# Altium schematic sheet Net.SchDoc: 网络接口
size A4; Author: 陈世豪
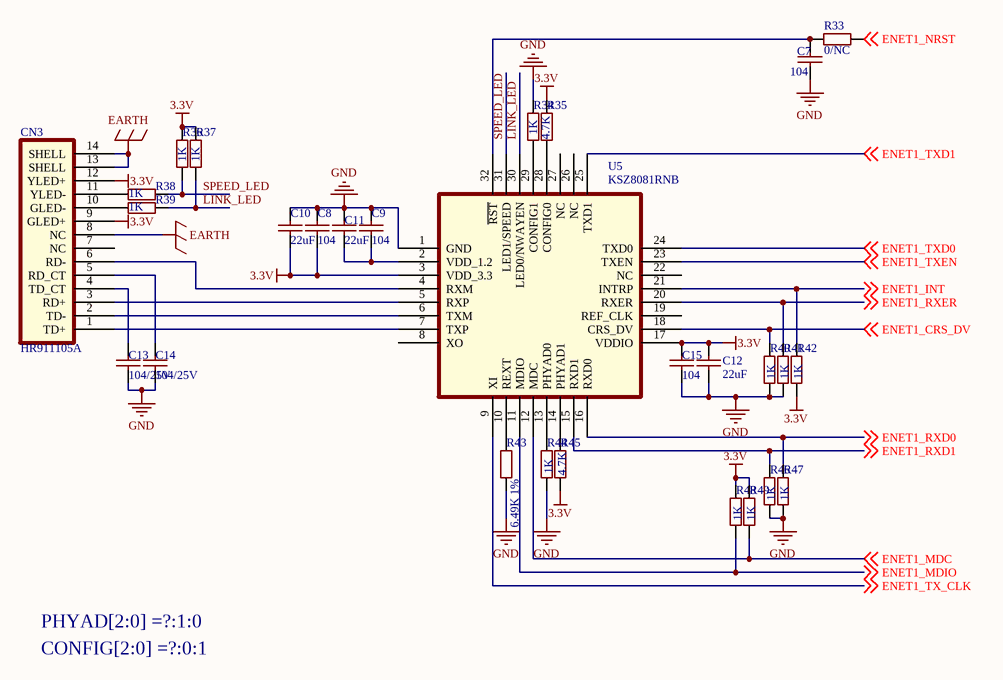
[diagram p0: Net.SchDoc]

## Parts
C7  104  [0805SMD_Cap]
C8  104  [0805SMD_Cap]
C9  104  [0805SMD_Cap]
C10  22uF  [0805SMD_Cap]
C11  22uF  [0805SMD_Cap]
C12  22uF  [0805SMD_Cap]
C13  104/25V  [0805SMD_Cap]
C14  104/25V  [0805SMD_Cap]
C15  104  [0805SMD_Cap]
CN3  HR911105A  [RJ-45A12]
R33  0/NC  [0805_SMD_R]
R34  1K  [0805_SMD_R]
R35  4.7K  [0805_SMD_R]
R36  1K  [0805_SMD_R]
R37  1K  [0805_SMD_R]
R38  1K  [0805_SMD_R]
R39  1K  [0805_SMD_R]
R40  1K  [0805_SMD_R]
R41  1K  [0805_SMD_R]
R42  1K  [0805_SMD_R]
R43  6.49K 1%  [0805_SMD_R]
R44  1K  [0805_SMD_R]
R45  4.7K  [0805_SMD_R]
R46  1K  [0805_SMD_R]
R47  1K  [0805_SMD_R]
R48  1K  [0805_SMD_R]
R49  1K  [0805_SMD_R]
U5  KSZ8081RNB  [LC-QFN-32_5x5x05P]

## Nets
3.3V: C8.2 C10.1 C12.1 C15.2 CN3.9(GLED+) CN3.12(YLED+) R35.2 R36.2 R37.2 R42.2 R45.2 R48.2 R49.2 U5.3(VDD_3.3) U5.17(VDDIO)
EARTH: CN3.8(NC) CN3.13(SHELL) CN3.14(SHELL)
GND: C7.1 C8.1 C9.1 C10.2 C11.2 C12.2 C13.1 C14.1 C15.1 R34.2 R40.1 R41.1 R43.1 R44.1 R46.1 R47.1 U5.1(GND)
ENET1_CRS_DV: R40.2 U5.18(CRS_DV) ; off-sheet ENET1_CRS_DV
ENET1_INT: R42.1 U5.21(INTRP) ; off-sheet ENET1_INT
ENET1_MDC: R49.1 U5.12(MDC) ; off-sheet ENET1_MDC
ENET1_MDIO: R48.1 U5.11(MDIO) ; off-sheet ENET1_MDIO
ENET1_NRST: R33.1 ; off-sheet ENET1_NRST
ENET1_RXD0: R47.2 U5.16(RXD0) ; off-sheet ENET1_RXD0
ENET1_RXD1: R46.2 U5.15(RXD1) ; off-sheet ENET1_RXD1
ENET1_RXER: R41.2 U5.20(RXER) ; off-sheet ENET1_RXER
ENET1_TX_CLK: U5.9(XI) ; off-sheet ENET1_TX_CLK
ENET1_TXD0: U5.24(TXD0) ; off-sheet ENET1_TXD0
ENET1_TXD1: U5.25(TXD1) ; off-sheet ENET1_TXD1
ENET1_TXEN: U5.23(TXEN) ; off-sheet ENET1_TXEN
LINK_LED: R37.1 R39.2 U5.30(LED0/NWAYEN)
SPEED_LED: R36.1 R38.2 U5.31(LED1/SPEED)
NetC7_2: C7.2 R33.2 U5.32(~{RST})
NetC9_2: C9.2 C11.1 U5.2(VDD_1.2)
NetC13_2: C13.2 CN3.4(TD_CT)
NetC14_2: C14.2 CN3.5(RD_CT)
NetCN3_1: CN3.1(TD+) U5.7(TXP)
NetCN3_2: CN3.2(TD-) U5.6(TXM)
NetCN3_3: CN3.3(RD+) U5.5(RXP)
NetCN3_6: CN3.6(RD-) U5.4(RXM)
NetCN3_10: CN3.10(GLED-) R39.1
NetCN3_11: CN3.11(YLED-) R38.1
NetR34_1: R34.1 U5.29(CONFIG1)
NetR35_1: R35.1 U5.28(CONFIG0)
NetR43_2: R43.2 U5.10(REXT)
NetR44_2: R44.2 U5.13(PHYAD0)
NetR45_1: R45.1 U5.14(PHYAD1)

Not connected (* = marked no-connect by the designer): CN3 7(NC); U5 8(XO) 19(REF_CLK) 22(NC) 26(NC) 27(NC)

## Notes on the sheet
- PHYAD[2:0] =?:1:0
- CONFIG[2:0] =?:0:1

## Library data of the parts
C7-C15 = SMD_Cap: 贴片电容; 研究所: 贴装电容_0805_4700pF; 松下: GR21BB1H472K
R33-R49 = SMD_0805: 贴片电阻; 松下: RS05K101FT; 松下: RS05000FT; 松下: RS05K3321FT; 松下: RS05K6811FT; 松下: RS05K102FT; 松下: RS05K2211FT; 松下: RS05K103FT; 松下: RS05K5111FT; 松下: RS05K5110FT; 松下: RS05K5112FT; 松下: RS05K8251FT; 松下: RS05K2212FT; 松下: RS05K104FT; 松下: RS05K5113FT; 松下: RS05K105FT; 松下: RS05L106FT; 研究所: 贴装电阻_0805_0_F1%; 研究所: 贴装电阻_0805_100_F1%; 研究所: 贴装电阻_0805_51.1K_F1%; 研究所: 贴装电阻_0805_1K_F1%; 研究所: 贴装电阻_0805_2.21K_F1%; 研究所: 贴装电阻_0805_3.32K_F1%; 研究所: 贴装电阻_0805_5.11K_F1%; 研究所: 贴装电阻_0805_511K_F1%; 研究所: 贴装电阻_0805_6.81K_F1%; 研究所: 贴装电阻_0805_511_F1%; 研究所: 贴装电阻_0805_8.25K_F1%; 研究所: 贴装电阻_0805_10K_F1%; 研究所: 贴装电阻_0805_22.1K_F1%; 研究所: 贴装电阻_0805_100K_F1%; 研究所: 贴装电阻_0805_1M_F1%; 研究所: 贴装电阻_0805_10M_F1%